# Altium schematic sheet ENCODER_Ctrl.SchDoc
size A4
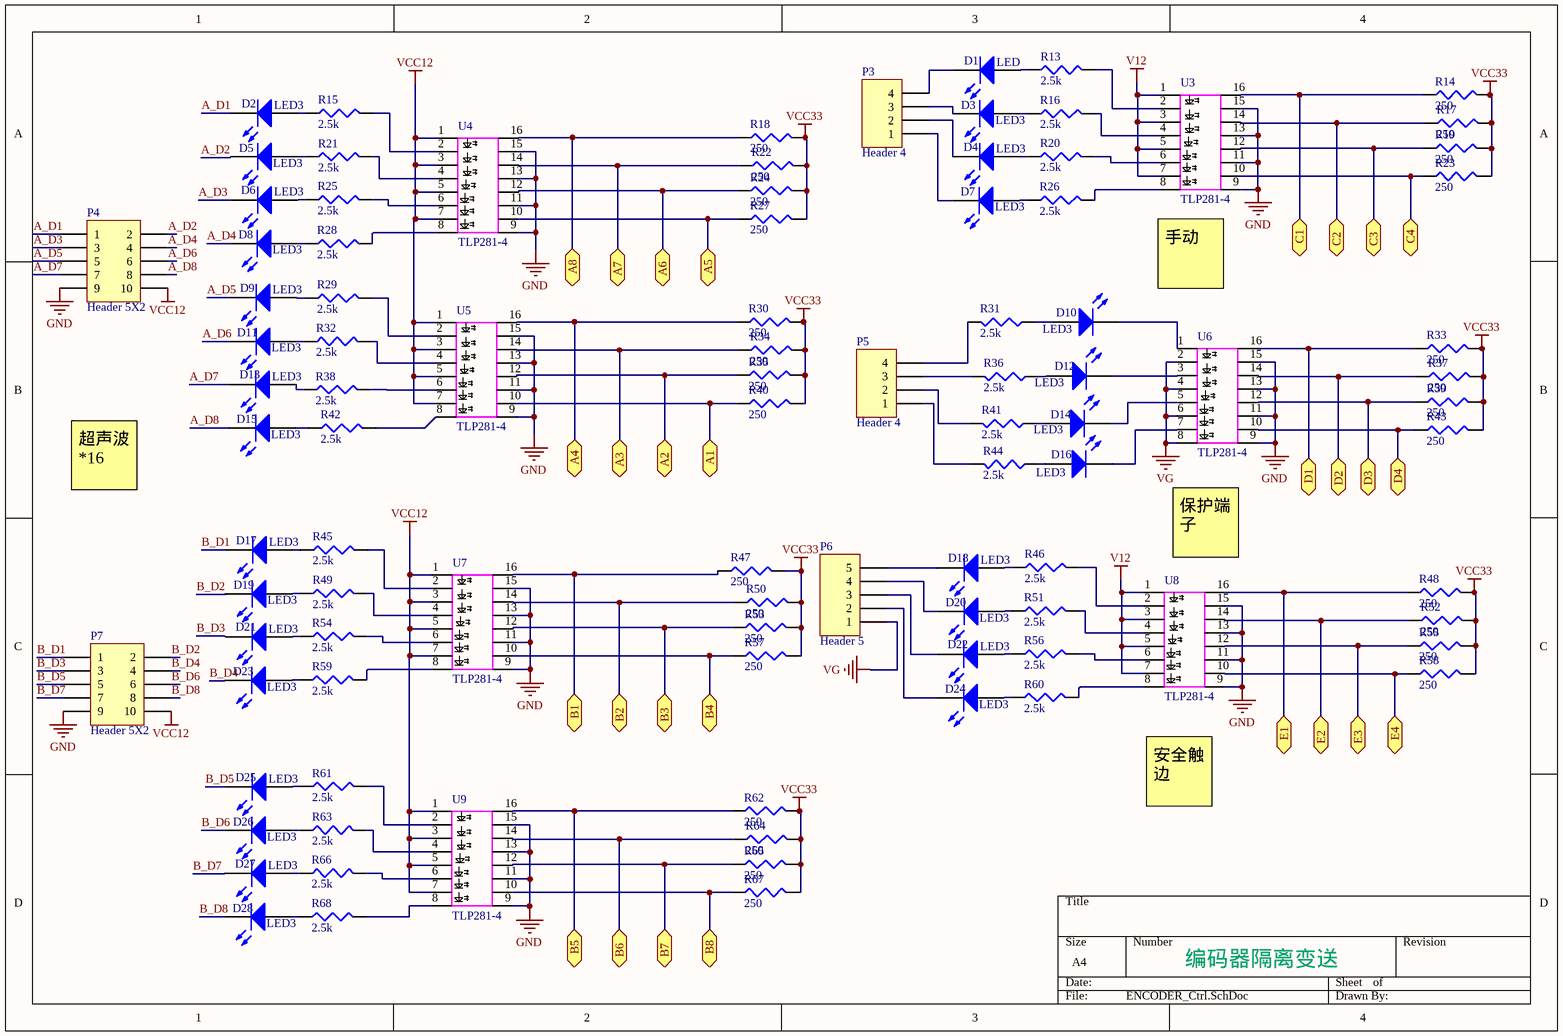
[diagram p0: ENCODER_Ctrl.SchDoc]

## Parts
D1  LED  [LED-1206]
D2  LED3  [LED-1206]
D3  LED3  [LED-1206]
D4  LED3  [LED-1206]
D5  LED3  [LED-1206]
D6  LED3  [LED-1206]
D7  LED3  [LED-1206]
D8  LED3  [LED-1206]
D9  LED3  [LED-1206]
D10  LED3  [LED-1206]
D11  LED3  [LED-1206]
D12  LED3  [LED-1206]
D13  LED3  [LED-1206]
D14  LED3  [LED-1206]
D15  LED3  [LED-1206]
D16  LED3  [LED-1206]
D17  LED3  [LED-1206]
D18  LED3  [LED-1206]
D19  LED3  [LED-1206]
D20  LED3  [LED-1206]
D21  LED3  [LED-1206]
D22  LED3  [LED-1206]
D23  LED3  [LED-1206]
D24  LED3  [LED-1206]
D25  LED3  [LED-1206]
D26  LED3  [LED-1206]
D27  LED3  [LED-1206]
D28  LED3  [LED-1206]
P3  Header 4  [3.81-4P]
P4  Header 5X2  [HDR2X5]
P5  Header 4  [3.81-4P]
P6  Header 5  [3.81-5P]
P7  Header 5X2  [HDR2X5]
R13  value 2.5k  [1206R]  (hidden comment: Res3)
R14  value 250  [1206R]  (hidden comment: Res3)
R15  value 2.5k  [1206R]  (hidden comment: Res3)
R16  value 2.5k  [1206R]  (hidden comment: Res3)
R17  value 250  [1206R]  (hidden comment: Res3)
R18  value 250  [1206R]  (hidden comment: Res3)
R19  value 250  [1206R]  (hidden comment: Res3)
R20  value 2.5k  [1206R]  (hidden comment: Res3)
R21  value 2.5k  [1206R]  (hidden comment: Res3)
R22  value 250  [1206R]  (hidden comment: Res3)
R23  value 250  [1206R]  (hidden comment: Res3)
R24  value 250  [1206R]  (hidden comment: Res3)
R25  value 2.5k  [1206R]  (hidden comment: Res3)
R26  value 2.5k  [1206R]  (hidden comment: Res3)
R27  value 250  [1206R]  (hidden comment: Res3)
R28  value 2.5k  [1206R]  (hidden comment: Res3)
R29  value 2.5k  [1206R]  (hidden comment: Res3)
R30  value 250  [1206R]  (hidden comment: Res3)
R31  value 2.5k  [1206R]  (hidden comment: Res3)
R32  value 2.5k  [1206R]  (hidden comment: Res3)
R33  value 250  [1206R]  (hidden comment: Res3)
R34  value 250  [1206R]  (hidden comment: Res3)
R35  value 250  [1206R]  (hidden comment: Res3)
R36  value 2.5k  [1206R]  (hidden comment: Res3)
R37  value 250  [1206R]  (hidden comment: Res3)
R38  value 2.5k  [1206R]  (hidden comment: Res3)
R39  value 250  [1206R]  (hidden comment: Res3)
R40  value 250  [1206R]  (hidden comment: Res3)
R41  value 2.5k  [1206R]  (hidden comment: Res3)
R42  value 2.5k  [1206R]  (hidden comment: Res3)
R43  value 250  [1206R]  (hidden comment: Res3)
R44  value 2.5k  [1206R]  (hidden comment: Res3)
R45  value 2.5k  [1206R]  (hidden comment: Res3)
R46  value 2.5k  [1206R]  (hidden comment: Res3)
R47  value 250  [1206R]  (hidden comment: Res3)
R48  value 250  [1206R]  (hidden comment: Res3)
R49  value 2.5k  [1206R]  (hidden comment: Res3)
R50  value 250  [1206R]  (hidden comment: Res3)
R51  value 2.5k  [1206R]  (hidden comment: Res3)
R52  value 250  [1206R]  (hidden comment: Res3)
R53  value 250  [1206R]  (hidden comment: Res3)
R54  value 2.5k  [1206R]  (hidden comment: Res3)
R55  value 250  [1206R]  (hidden comment: Res3)
R56  value 2.5k  [1206R]  (hidden comment: Res3)
R57  value 250  [1206R]  (hidden comment: Res3)
R58  value 250  [1206R]  (hidden comment: Res3)
R59  value 2.5k  [1206R]  (hidden comment: Res3)
R60  value 2.5k  [1206R]  (hidden comment: Res3)
R61  value 2.5k  [1206R]  (hidden comment: Res3)
R62  value 250  [1206R]  (hidden comment: Res3)
R63  value 2.5k  [1206R]  (hidden comment: Res3)
R64  value 250  [1206R]  (hidden comment: Res3)
R65  value 250  [1206R]  (hidden comment: Res3)
R66  value 2.5k  [1206R]  (hidden comment: Res3)
R67  value 250  [1206R]  (hidden comment: Res3)
R68  value 2.5k  [1206R]  (hidden comment: Res3)
U3  TLP281-4  [SO16]
U4  TLP281-4  [SO16]
U5  TLP281-4  [SO16]
U6  TLP281-4  [SO16]
U7  TLP281-4  [SO16]
U8  TLP281-4  [SO16]
U9  TLP281-4  [SO16]

## Ports
A1, A2, A3, A4, A5, A6, A7, A8, B1, B2, B3, B4, B5, B6, B7, B8, C1, C2, C3, C4, D1, D2, D3, D4, E1, E2, E3, E4

## Nets
GND: P4.9 P7.9 U3.9 U3.11 U3.13 U3.15 U4.9 U4.11 U4.13 U4.15 U5.9 U5.11 U5.13 U5.15 U6.9 U6.11 U6.13 U6.15 U7.9 U7.11 U7.13 U7.15 U8.9 U8.11 U8.13 U8.15 U9.9 U9.11 U9.13 U9.15
V12: U3.1 U3.3 U3.5 U3.7 U8.1 U8.3 U8.5 U8.7
VCC12: P4.10 P7.10 U4.1 U4.3 U4.5 U4.7 U5.1 U5.3 U5.5 U5.7 U7.1 U7.3 U7.5 U7.7 U9.1 U9.3 U9.5 U9.7
VCC33: R14.2 R17.2 R18.2 R19.2 R22.2 R23.2 R24.2 R27.2 R30.2 R33.2 R34.2 R35.2 R37.2 R39.2 R40.2 R43.2 R47.2 R48.2 R50.2 R52.2 R53.2 R55.2 R57.2 R58.2 R62.2 R64.2 R65.2 R67.2
VG: P6.1 U6.2 U6.4 U6.6 U6.8
A1: R40.1 U5.10 ; port A1
A2: R35.1 U5.12 ; port A2
A3: R34.1 U5.14 ; port A3
A4: R30.1 U5.16 ; port A4
A5: R27.1 U4.10 ; port A5
A6: R24.1 U4.12 ; port A6
A7: R22.1 U4.14 ; port A7
A8: R18.1 U4.16 ; port A8
A_D1: D2.2(K) P4.1
A_D2: D5.2(K) P4.2
A_D3: D6.2(K) P4.3
A_D4: D8.2(K) P4.4
A_D5: D9.2(K) P4.5
A_D6: D11.2(K) P4.6
A_D7: D13.2(K) P4.7
A_D8: D15.2(K) P4.8
B1: R47.1 U7.16 ; port B1
B2: R50.1 U7.14 ; port B2
B3: R53.1 U7.12 ; port B3
B4: R57.1 U7.10 ; port B4
B5: R62.1 U9.16 ; port B5
B6: R64.1 U9.14 ; port B6
B7: R65.1 U9.12 ; port B7
B8: R67.1 U9.10 ; port B8
B_D1: D17.2(K) P7.1
B_D2: D19.2(K) P7.2
B_D3: D21.2(K) P7.3
B_D4: D23.2(K) P7.4
B_D5: D25.2(K) P7.5
B_D6: D26.2(K) P7.6
B_D7: D27.2(K) P7.7
B_D8: D28.2(K) P7.8
C1: R14.1 U3.16 ; port C1
C2: R17.1 U3.14 ; port C2
C3: R19.1 U3.12 ; port C3
C4: R23.1 U3.10 ; port C4
D1: R33.1 U6.16 ; port D1
D2: R37.1 U6.14 ; port D2
D3: R39.1 U6.12 ; port D3
D4: R43.1 U6.10 ; port D4
E1: R48.1 U8.16 ; port E1
E2: R52.1 U8.14 ; port E2
E3: R55.1 U8.12 ; port E3
E4: R58.1 U8.10 ; port E4
NetD1_1: D1.1(A) R13.1
NetD1_2: D1.2(K) P3.4
NetD2_1: D2.1(A) R15.1
NetD3_1: D3.1(A) R16.1
NetD3_2: D3.2(K) P3.3
NetD4_1: D4.1(A) R20.1
NetD4_2: D4.2(K) P3.2
NetD5_1: D5.1(A) R21.1
NetD6_1: D6.1(A) R25.1
NetD7_1: D7.1(A) R26.1
NetD7_2: D7.2(K) P3.1
NetD8_1: D8.1(A) R28.1
NetD9_1: D9.1(A) R29.1
NetD10_1: D10.1(A) R31.1
NetD10_2: D10.2(K) U6.1
NetD11_1: D11.1(A) R32.1
NetD12_1: D12.1(A) R36.1
NetD12_2: D12.2(K) U6.3
NetD13_1: D13.1(A) R38.1
NetD14_1: D14.1(A) R41.1
NetD14_2: D14.2(K) U6.5
NetD15_1: D15.1(A) R42.1
NetD16_1: D16.1(A) R44.1
NetD16_2: D16.2(K) U6.7
NetD17_1: D17.1(A) R45.1
NetD18_1: D18.1(A) R46.1
NetD18_2: D18.2(K) P6.5
NetD19_1: D19.1(A) R49.1
NetD20_1: D20.1(A) R51.1
NetD20_2: D20.2(K) P6.4
NetD21_1: D21.1(A) R54.1
NetD22_1: D22.1(A) R56.1
NetD22_2: D22.2(K) P6.3
NetD23_1: D23.1(A) R59.1
NetD24_1: D24.1(A) R60.1
NetD24_2: D24.2(K) P6.2
NetD25_1: D25.1(A) R61.1
NetD26_1: D26.1(A) R63.1
NetD27_1: D27.1(A) R66.1
NetD28_1: D28.1(A) R68.1
NetP5_1: P5.1 R44.2
NetP5_2: P5.2 R41.2
NetP5_3: P5.3 R36.2
NetP5_4: P5.4 R31.2
NetR13_2: R13.2 U3.2
NetR15_2: R15.2 U4.2
NetR16_2: R16.2 U3.4
NetR20_2: R20.2 U3.6
NetR21_2: R21.2 U4.4
NetR25_2: R25.2 U4.6
NetR26_2: R26.2 U3.8
NetR28_2: R28.2 U4.8
NetR29_2: R29.2 U5.2
NetR32_2: R32.2 U5.4
NetR38_2: R38.2 U5.6
NetR42_2: R42.2 U5.8
NetR45_2: R45.2 U7.2
NetR46_2: R46.2 U8.2
NetR49_2: R49.2 U7.4
NetR51_2: R51.2 U8.4
NetR54_2: R54.2 U7.6
NetR56_2: R56.2 U8.6
NetR59_2: R59.2 U7.8
NetR60_2: R60.2 U8.8
NetR61_2: R61.2 U9.2
NetR63_2: R63.2 U9.4
NetR66_2: R66.2 U9.6
NetR68_2: R68.2 U9.8

## Notes on the sheet
- (near U3) 手动
- 超声波*16
- 保护端子
- (near U8) 安全触边
- 编码器隔离变送

## Library data of the parts
D1-D28 = LED3: Typical BLUE SiC LED; Published: 8-Jun-2000; LatestRevisionDate: 17-Dec-2003; LatestRevisionNote: PCB Footprint replaced.; DatasheetVersion: 16-Apr-2002; PackageVersion: 16-Apr-2002; PackageReference: 3.5X2.8X1.9; Publisher: Altium Limited
P3 P5 = Header 4: Header, 4-Pin; LatestRevisionDate: 17-Jul-2002; LatestRevisionNote: Re-released for DXP Platform.; Publisher: Altium Limited
P4 P7 = Header 5X2: Header, 5-Pin, Dual row; LatestRevisionDate: 17-Jul-2002; LatestRevisionNote: Re-released for DXP Platform.; Publisher: Altium Limited
P6 = Header 5: Header, 5-Pin; LatestRevisionDate: 17-Jul-2002; LatestRevisionNote: Re-released for DXP Platform.; Publisher: Altium Limited
R13-R68 = Res3: Resistor; Published: 8-Jun-2000; LatestRevisionDate: 29-May-2009; LatestRevisionNote: IPC-7351 Footprint Added.; PackageReference: J1-0603; Publisher: Altium Limited; PackageDescription: Chip Resistor